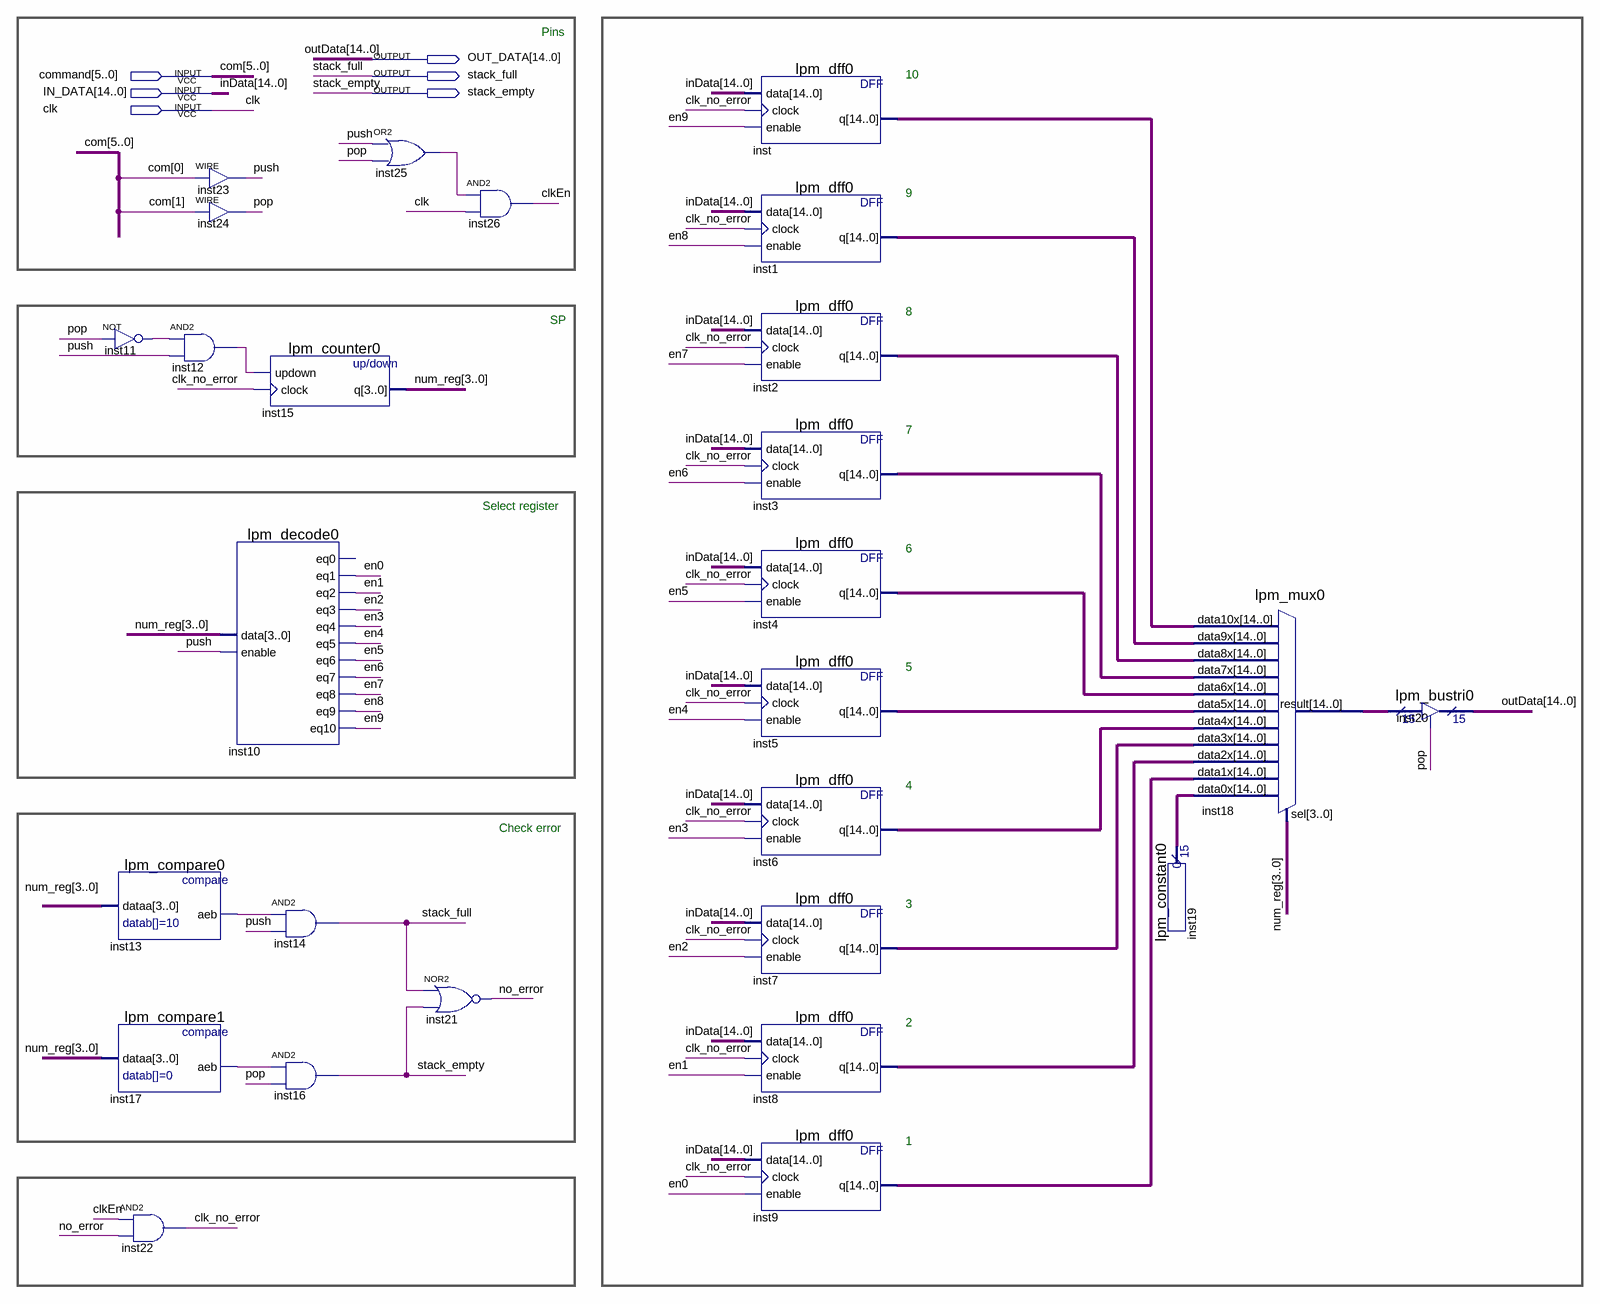
[diagram p0: schematic sheet]
// Quartus schematic stack.bdf as structural Verilog: 27 symbols, 6 pins
module stack (
  input  [5:0] command,
  input  [14:0] IN_DATA,
  input  clk,
  output [14:0] OUT_DATA,
  output stack_full,
  output stack_empty
);

  wire clk_no_error, clkEn, en0, en1, en2, en3, en4, en5, en6, en7, en8, en9, inst11_out, inst12_out,
       inst13_aeb, inst17_aeb, inst25_out, no_error, pop, push;
  wire [3:0] num_reg;
  wire [14:0] inst1_q, inst2_q, inst3_q, inst4_q, inst5_q, inst6_q, inst7_q, inst8_q, inst9_q, inst18_result,
       inst19_result, inst_q;

  not inst11 (inst11_out, pop);
  lpm_compare0 inst13 (.dataa(num_reg), .aeb(inst13_aeb));
  lpm_compare1 inst17 (.dataa(num_reg), .aeb(inst17_aeb));
  and inst22 (clk_no_error, clkEn, no_error);
  assign push = command[0];  // WIRE inst23
  assign pop = command[1];  // WIRE inst24
  and inst12 (inst12_out, inst11_out, push);
  lpm_decode0 inst10 (
    .data(num_reg), .enable(push), .eq1(en0), .eq2(en1), .eq3(en2), .eq4(en3), .eq5(en4), .eq6(en5),
    .eq7(en6), .eq8(en7), .eq9(en8), .eq10(en9));  // open: eq0
  lpm_counter0 inst15 (.updown(inst12_out), .clock(clk_no_error), .q(num_reg));
  and inst14 (stack_full, inst13_aeb, push);
  and inst16 (stack_empty, inst17_aeb, pop);
  or inst25 (inst25_out, push, pop);
  nor inst21 (no_error, stack_full, stack_empty);
  and inst26 (clkEn, inst25_out, clk);
  lpm_dff0 inst (.data(IN_DATA), .clock(clk_no_error), .enable(en9), .q(inst_q));
  lpm_dff0 inst1 (.data(IN_DATA), .clock(clk_no_error), .enable(en8), .q(inst1_q));
  lpm_dff0 inst2 (.data(IN_DATA), .clock(clk_no_error), .enable(en7), .q(inst2_q));
  lpm_dff0 inst3 (.data(IN_DATA), .clock(clk_no_error), .enable(en6), .q(inst3_q));
  lpm_dff0 inst4 (.data(IN_DATA), .clock(clk_no_error), .enable(en5), .q(inst4_q));
  lpm_dff0 inst5 (.data(IN_DATA), .clock(clk_no_error), .enable(en4), .q(inst5_q));
  lpm_dff0 inst6 (.data(IN_DATA), .clock(clk_no_error), .enable(en3), .q(inst6_q));
  lpm_dff0 inst7 (.data(IN_DATA), .clock(clk_no_error), .enable(en2), .q(inst7_q));
  lpm_dff0 inst8 (.data(IN_DATA), .clock(clk_no_error), .enable(en1), .q(inst8_q));
  lpm_dff0 inst9 (.data(IN_DATA), .clock(clk_no_error), .enable(en0), .q(inst9_q));
  lpm_constant0 inst19 (.result(inst19_result));
  lpm_mux0 inst18 (
    .data10x(inst_q), .data9x(inst1_q), .data8x(inst2_q), .data7x(inst3_q), .data6x(inst4_q),
    .data5x(inst5_q), .data4x(inst6_q), .data3x(inst7_q), .data2x(inst8_q), .data1x(inst9_q),
    .data0x(inst19_result), .sel(num_reg), .result(inst18_result));
  lpm_bustri0 inst20 (.enabledt(pop), .data(inst18_result), .tridata(OUT_DATA));

  // Other names for the same wires on the sheet: com[5:0] = command; inData[14:0] = IN_DATA; outData[14:0] = OUT_DATA

  // Notes on the sheet:
  //   Pins
  //   10
  //   9
  //   8
  //   SP
  //   7
  //   Select register
  //   6
  //   5
  //   4
  //   Check error
  //   3
  //   2
  //   1
endmodule
